# Altium project MAIN-VNH7070.PrjPcb
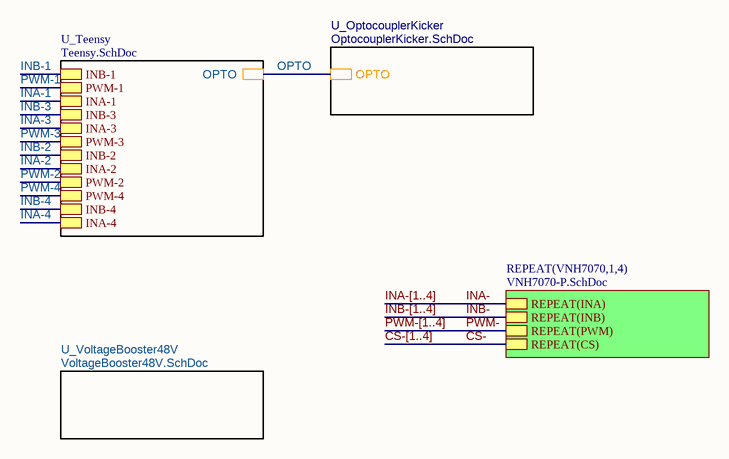
[diagram p0: TopLevel.SchDoc]
5 sheets, 108 parts. Net scope: hierarchical (ports join the sheet entries above them; power ports are global).
Board file: MAIN-VNH7070.PcbDoc
Sheets:
  TopLevel.SchDoc
    U_VoltageBooster48V = VoltageBooster48V.SchDoc
    U_Teensy = Teensy.SchDoc
    U_OptocouplerKicker = OptocouplerKicker.SchDoc
    VNH70701 = VNH7070-P.SchDoc
    VNH70702 = VNH7070-P.SchDoc
    VNH70703 = VNH7070-P.SchDoc
    VNH70704 = VNH7070-P.SchDoc

## Sheet TopLevel.SchDoc
size A; SheetNumber: 1; SheetTotal: 5

### Sub-sheets
REPEAT(VNH7070,1,4) = VNH7070-P.SchDoc: REPEAT(INA), REPEAT(INB), REPEAT(PWM), REPEAT(CS)
U_OptocouplerKicker = OptocouplerKicker.SchDoc: OPTO
U_Teensy = Teensy.SchDoc: OPTO, INB-1, PWM-1, INA-1, INB-3, INA-3, PWM-3, INB-2, INA-2, PWM-2, PWM-4, INB-4, INA-4
U_VoltageBooster48V = VoltageBooster48V.SchDoc: no entries

### Nets
CS-: sheet REPEAT(VNH7070,1,4)/REPEAT(CS)
INA-: sheet REPEAT(VNH7070,1,4)/REPEAT(INA)
INB-: sheet REPEAT(VNH7070,1,4)/REPEAT(INB)
OPTO: sheet U_Teensy/OPTO, sheet U_OptocouplerKicker/OPTO
PWM-: sheet REPEAT(VNH7070,1,4)/REPEAT(PWM)

### Buses and harness runs
bus CS-[1..4]
bus INA-[1..4]
bus INB-[1..4]
bus PWM-[1..4]

## Sheet VoltageBooster48V.SchDoc
size A; SheetNumber: 5; SheetTotal: 5
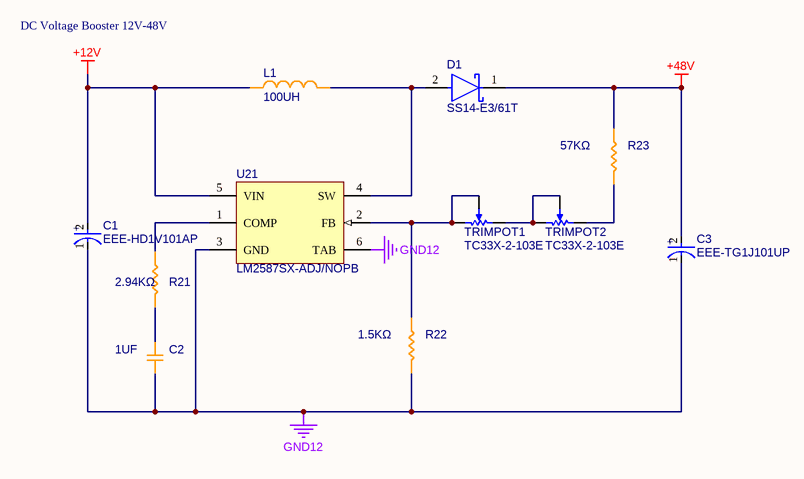
[diagram p1: VoltageBooster48V.SchDoc]

### Parts
C1  EEE-HD1V101AP  [FP-HDG-MFG]
C2  1UF  [CAP_0603]
C3  EEE-TG1J101UP  [FP-TGG-MFG]
D1  SS14-E3/61T  [FP-95400-MFG]
L1  100UH  [IND_Boost]
R21  2.94KΩ  [RES_0603]
R22  1.5KΩ  [RES_0603]
R23  57KΩ  [RES_0603]
TRIMPOT1  TC33X-2-103E  [BOUR-TC33X-2_V]
TRIMPOT2  TC33X-2-103E  [BOUR-TC33X-2_V]
U21  LM2587SX-ADJ/NOPB  [KTT0005B_N]

### Nets
+12V: C1.2(A) L1.1 U21.5(VIN)
+48V: C3.2(A) D1.1(C) R23.2
GND12: C1.1(C) C2.1 C3.1(C) R22.1 U21.3(GND) U21.6(TAB)  [project net GND]
NetC2_2: C2.2 R21.1
NetD1_2: D1.2(A) L1.2 U21.4(SW)
NetR21_2: R21.2 U21.1(COMP)
NetR22_2: R22.2 TRIMPOT1.1 TRIMPOT1.2 U21.2(FB)
NetR23_1: R23.1 TRIMPOT2.3
NetTRIMPOT1_3: TRIMPOT1.3 TRIMPOT2.1 TRIMPOT2.2

### Notes on the sheet
- DC Voltage Booster 12V-48V
- (in symbol CMP-00287-42869300-1) +
- (in symbol CMP-05427-002169-1) +

### Library data of the parts
C1 = CMP-00287-42869300-1: EEE-HD1V101AP Aluminum Electrolytic Capacitor, 100 uF, 35 V, ± 20%, 5000 hours @ 105°C, Radial Can - SMD; Voltage: 35V; ESR (Equivalent Series Resistance): 800mΩ; Ripple Current (AC): 101mA; Leakage Current: 35µA; Dissipation Factor: 14%; Dielectric Material: Aluminium; Capacitance: 100µF; Lifecycle Status: Production; Life (Hours): 5000hours; Tolerance: 20%; Height - Seated (Max): 10.2108mm; Number of Pins: 2; Length: 10.5mm; REACH SVHC: No SVHC; Min Operating Temperature: -40°C; Mount: PCB, Surface Mount; Lead Pitch: 4.6mm; Voltage Rating (DC): 35V; Lead Free: Lead Free; RoHS: Compliant; Ripple Current: 101mA; Height: 10.2mm; Termination: SMD/SMT; NexarPartId: 42869300; Packaging: Cut Tape; Radiation Hardening: No; Case/Package: Radial; Voltage Rating: 35V; Schedule B: 8532220020, 8532220020; Diameter: 10mm; Max Operating Temperature: 105°C; Impedance: 800mΩ
C2 = CAP_0603: Capacitor SMD 0603 generic
C3 = CMP-05427-002169-1: CAP ALUM 100UF 20% 63V SMD; ESR (Equivalent Series Resistance): 800mR; Ripple Current: 150mA; Dissipation Factor: 0.12%; Life (Hours): 2000Hour; Package Quantity: 500; Series: TG; Height: 10.2mm; Construction: Cylindrical; Lead Free: Lead Free; Ratings: AEC-Q200; Mount: Surface Mount; Termination: SMD/SMT; Case/Package: Radial; Length: 10.2mm; Diameter: 10mm; Height - Seated (Max): 0.402inch; Reach SVHC Compliant: Yes; Capacitance: 100uF; Packaging: Tape and Reel; Max Operating Temperature: 125°C; Voltage: 63V; RoHS Compliant: Yes; Tolerance: 20%; Min Operating Temperature: -40°C; Voltage Rating: 63V; Width: 900um; Ripple Current (AC): 150mA; Voltage Rating (DC): 63V; Contact Plating: Tin; Radiation Hardening: No
D1 = CMP-02539-000035-1: DIODE SCHOTTKY 40V 1A DO214AC; Manufacturer: Vishay; Peak Reverse Current: 0.2mA; Standoff Height: 0mm; Max Junction Temp: +150°C; Max Surge Forward Current: 40A; RoHS: TRUE; Digikey Description: DIODE SCHOTTKY 40V 1A DO214AC; Category: Diode; Device Class L3: Schottky Diodes; Temperature Range High: +150°C; Automotive: No; Temperature: -65°C to +150°C; Device Class L2: Diodes; Forward Current: 1A; Temperature Range Low: -65°C; Footprint Url: http://www.vishay.com/docs/95400/sma.pdf; Octopart: https://octopart.com/ss14-e3%2F61t-vishay-39552847; Package: 95400; Max Repetitive Reverse Voltage: 40V; ComponentLink2Description: Datasheet; ComponentLink2URL: http://www.vishay.com/docs/88746/ss12.pdf; Lead Free: Yes; Height: 2.29mm; Mouser Description: SS14 Series 40 V 1 A Surface Mount Schottky Barrier Rectifier - DO-214AC (SMA); Manufacturer Part Number: SS14-E3/61T; Device Class L1: Discrete Semiconductors
L1 = Boost Inductor: Voltage Boost Inductor
R21-R23 = RES_0603: Resistor SMD 0603 generic
TRIMPOT1 TRIMPOT2 = CMP-2100-03695-1: Trimming Potentiometer, 10000 Ohm, -40 to 100 degC, 3-Pin SMD, RoHS, Tape and Reel; Manufacturer: Bourns; Tolerance: 25%; Max Power Dissipation: 100mW; Number of Turns: 1; Resistance: 10KOhm; Temperature Coefficient: 250ppm/degreesC; Voltage Rating (DC): 50V; Datasheet URL: http://www.bourns.com/docs/Product-Datasheets/TC33.pdf; Composition: Potentiometer; Package Description: 3-Pin Surface Mount Device, Body 3.8 x 3.6 mm; Weight: 29.4mg; Power Rating: 100mW; Termination: FootPrint; Manufacturer URL: http://www.bourns.com/; Width: 0.118inch; Height: 0.047inch; Military Standard: Not; Radiation Hardening: No; Colour: Silver; Case/Package: SMD/SMT; Depth: 3.8mm; Min Operating Temperature: -40degC; Lead Free: LeadFree; Datasheet Version: 42583.0; REACH SVHC: NoSVHC; Length: 3mm; RoHSCompliant: true; Contact Plating: Silver; Taper: Linear; Packaging: TapeandReel; Mount: SurfaceMount; Max Operating Temperature: 100degC; Package Reference: TC33X-2; Package Quantity: 2500
U21 = CMP-0069-00069-3: 5A Flyback Regulator, 5-pin TO-263, Pb-Free; Manufacturer: Texas Instruments; PowerWise: N; CompType: Switcher; PackageTopMarking: NSUZXYTTE#*LM2587S*-ADJ P+; PackageDescription: TO-263, Molded, .400 x .390 x .180in, 5 Lead, .067in Pitch, Surface Mount; ComponentLink1URL: http://www.ti.com/general/docs/lit/getliterature.tsp?genericPartNumber=LM2587&fileType=pdf; Code_JEDEC: MO-169-AB; PinCount: 5; PackageReference: KTT0005B; ComponentLink1Description: Datasheet URL; RoHS: Y

## Sheet Teensy.SchDoc
size A; SheetNumber: 2; SheetTotal: 5
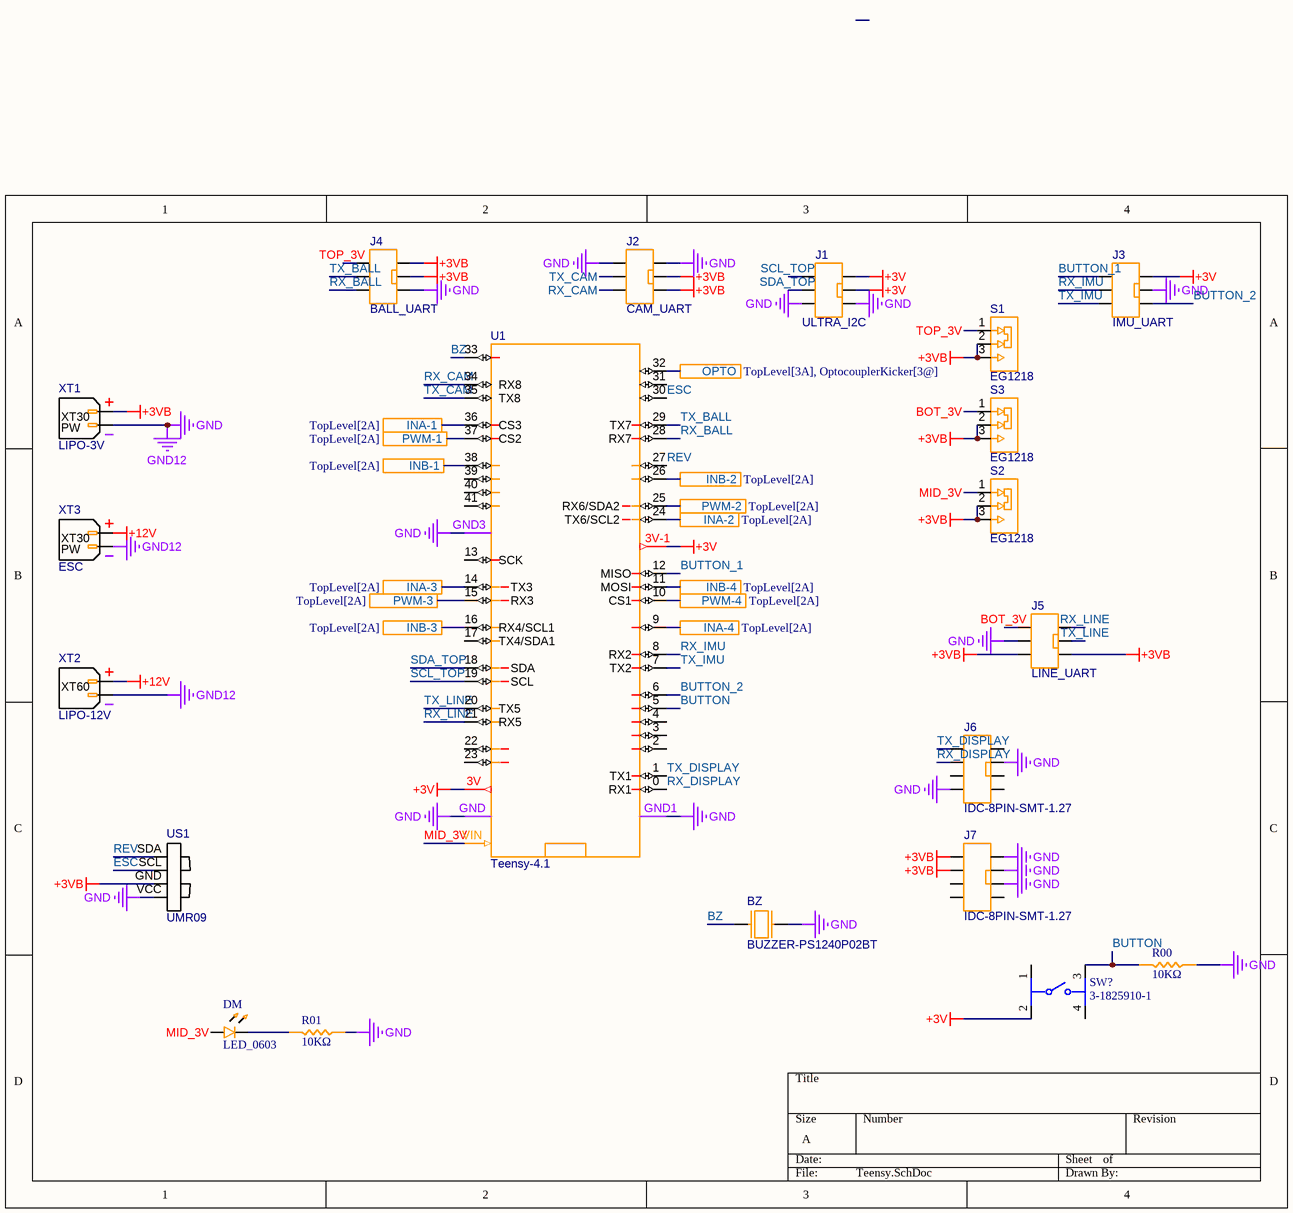
[diagram p2: Teensy.SchDoc]

### Parts
BZ  BUZZER-PS1240P02BT  [BUZZER-PS1240P02BT]
DM  LED_0603  [LED_0603]
J1  ULTRA_I2C  [IDC-6PIN-SMT-2.54]
J2  CAM_UART  [IDC-6PIN-SMT-2.54]
J3  IMU_UART  [IDC-6PIN-SMT-2.54]
J4  BALL_UART  [IDC-6PIN-SMT-2.54]
J5  LINE_UART  [IDC-6PIN-SMT-2.54]
J6  IDC-8PIN-SMT-1.27  [IDC-8PIN-SMT-1.27]
J7  IDC-8PIN-SMT-1.27  [IDC-8PIN-SMT-1.27]
R00  10KΩ  [RES_0603]
R01  10KΩ  [RES_0603]
S1  EG1218  [EG1218]
S2  EG1218  [EG1218]
S3  EG1218  [EG1218]
SW?  3-1825910-1  [FP-3-1825910-1-MFG]
U1  Teensy-4.1  [Teensy-4.1]
US1  UMR09  [URM09]
XT1  LIPO-3V  [XT30_PW_M]
XT2  LIPO-12V  [XT60-M]
XT3  ESC  [XT30_PW_M]

### Ports
INA-1 (see TopLevel[2A]), INA-2 (see TopLevel[2A]), INA-3 (see TopLevel[2A]), INA-4 (see TopLevel[2A]), INB-1 (see TopLevel[2A]), INB-2 (see TopLevel[2A]), INB-3 (see TopLevel[2A]), INB-4 (see TopLevel[2A]), OPTO (see TopLevel[3A], OptocouplerKicker[3@]), PWM-1 (see TopLevel[2A]), PWM-2 (see TopLevel[2A]), PWM-3 (see TopLevel[2A]), PWM-4 (see TopLevel[2A])

### Nets
+3V: J1.5 J1.6 J3.6 SW?.2 U1.3V U1.3V-1
+3VB: J2.4 J2.5 J4.5 J4.6 J5.3 J5.4 J7.1 J7.2 S1.2(COM) S1.3(NO) S2.2(COM) S2.3(NO) S3.2(COM) S3.3(NO) US1.GND XT1.P
+12V: XT2.P XT3.P
GND: BZ.2 J1.3 J1.4 J2.1 J2.6 J3.5 J4.4 J5.2 J6.4 J6.7 J7.6 J7.7 J7.8 R00.2 R01.2 U1.GND U1.GND1 U1.GND3 US1.VCC XT1.N XT2.N XT3.N  [also labelled GND12]
BOT_3V: J5.1 S3.1(NC)
BUTTON: R00.1 SW?.3 U1.5
BUTTON_1: J3.1 U1.12(MISO)
BUTTON_2: J3.4 U1.6
BZ: BZ.1 U1.33
ESC: U1.30 US1.SCL
INA-1: U1.36(CS3) ; port INA-1
INA-2: U1.24(TX6/SCL2) ; port INA-2
INA-3: U1.14(TX3) ; port INA-3
INA-4: U1.9 ; port INA-4
INB-1: U1.38 ; port INB-1
INB-2: U1.26 ; port INB-2
INB-3: U1.16(RX4/SCL1) ; port INB-3
INB-4: U1.11(MOSI) ; port INB-4
MID_3V: DM.A S2.1(NC) U1.VIN
OPTO: U1.32 ; port OPTO
PWM-1: U1.37(CS2) ; port PWM-1
PWM-2: U1.25(RX6/SDA2) ; port PWM-2
PWM-3: U1.15(RX3) ; port PWM-3
PWM-4: U1.10(CS1) ; port PWM-4
REV: U1.27 US1.SDA
RX_BALL: J4.3 U1.28(RX7)
RX_CAM: J2.3 U1.34(RX8)
RX_DISPLAY: J6.2 U1.0(RX1)
RX_IMU: J3.2 U1.8(RX2)
RX_LINE: J5.6 U1.21(RX5)
SCL_TOP: J1.1 U1.19(SCL)
SDA_TOP: J1.2 U1.18(SDA)
TOP_3V: J4.1 S1.1(NC)
TX_BALL: J4.2 U1.29(TX7)
TX_CAM: J2.2 U1.35(TX8)
TX_DISPLAY: J6.1 U1.1(TX1)
TX_IMU: J3.3 U1.7(TX2)
TX_LINE: J5.5 U1.20(TX5)
NetDM_C: DM.C R01.1

Not connected (* = marked no-connect by the designer): J6 3 5 6 8; J7 3 4 5; SW? 1 4; U1 2 3 4 13(SCK) 17(TX4/SDA1) 22 23 31 39 40 41

### Notes on the sheet
- (in symbol XT30_PW_M) XT30; PW
- (in symbol XT60-M) XT60

### Library data of the parts
J1-J5 = IDC-6PIN-SMT-2.54_1
R00 R01 = RES_0603: Resistor SMD 0603 generic
SW? = CMP-03407-000001-1: SWITCH TACTILE SPST-NO 0.05A 24V; Manufacturer: TE Connectivity; Operating Force: 160gf; Contact Current Rating: 50mA; Description: Switch Tactile OFF (ON) SPST Round Button PC Pins 0.05A 24VDC 100000Cycles 1.57N Thru-Hole; Contact Resistance: 100mΩ; Electromechanical Life: 100000Cycles; Device Class L1: Electromechanical; ComponentLink2URL: https://www.te.com/commerce/DocumentDelivery/DDEController?Action=srchrtrv&DocNm=1825910&DocType=Customer+Drawing&DocLang=English; Category: Switch; Device Class L2: Switches; Temperature: -35°C to +85°C; RoHS: TRUE; Mount: Through Hole; Manufacturer Part Number: 3-1825910-1; Automotive: No; Lead Free: Yes; Device Class L3: Tactile Switches; ComponentLink2Description: Datasheet; Temperature Range High: +85°C; Height: 17.3mm; Package: 0; Temperature Range Low: -35°C; Throw Configuration: SPST-NO; Digikey Description: SWITCH TACTILE SPST-NO 0.05A 24V; Octopart: https://octopart.com/3-1825910-1-te+connectivity-46506874
XT1 XT3 = XT30_PW_M
XT2 = XT60-M

## Sheet OptocouplerKicker.SchDoc
size A; SheetNumber: 3; SheetTotal: 5
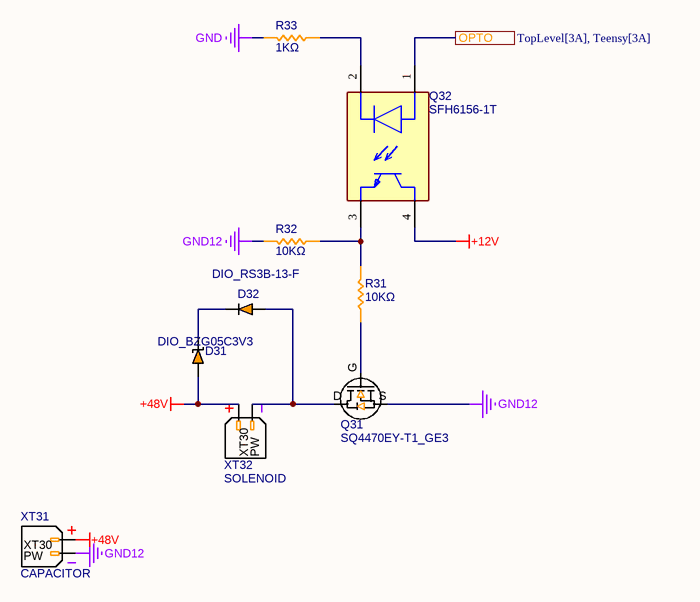
[diagram p3: OptocouplerKicker.SchDoc]

### Parts
D31  DIO_BZG05C3V3  [DIO_BZG05C3V3]
D32  DIO_RS3B-13-F  [DIO_RS3B-13-F]
Q31  SQ4470EY-T1_GE3  [SQ4470EY-T1_GE3]
Q32  SFH6156-1T  [FP-83911-MFG]
R31  10KΩ  [RES_0603]
R32  10KΩ  [RES_0603]
R33  1KΩ  [RES_0603]
XT31  CAPACITOR  [XT30_PW_M]
XT32  SOLENOID  [XT30_PW_M]

### Ports
OPTO (see TopLevel[3A], Teensy[3A])

### Nets
+12V: Q32.4(C)
+48V: D31.A XT31.P XT32.P
GND: Q31.S R32.1 R33.1 XT31.N  [also labelled GND12]
OPTO: Q32.1(A) ; port OPTO
NetD31_C: D31.C D32.C
NetD32_A: D32.A Q31.D XT32.N
NetQ31_G: Q31.G R31.2
NetQ32_2: Q32.2(C) R33.2
NetQ32_3: Q32.3(E) R31.1 R32.2

### Notes on the sheet
- (in symbol XT30_PW_M) XT30; PW

### Library data of the parts
Q32 = CMP-00030-03895371-1: SFH6156-1T Optocoupler Dc-in 1-CH Transistor Dc-out 4-PIN PDIP SMD T/r; Fall Time: 11s; Number of Elements: 1; Output Voltage: 70V; Forward Current: 60mA; Forward Voltage: 1.25V; Turn-On Delay Time: 3µs; Power Dissipation: 150mW; Isolation Voltage: 5.3kV; Collector Emitter Saturation Voltage: 400mV; Output Current per Channel: 50mA; Reverse Breakdown Voltage: 6V; Max Collector Current: 100mA; Current Transfer Ratio: 80%; Rise Time: 2s; Turn-Off Delay Time: 2.3µs; Mount: PCB, Surface Mount; NexarPartId: 3895371; Ambient Temperature Range High: 100°C; Number of Channels: 1; Number of Pins: 4; RoHS: Compliant; Max Output Voltage: 70V; Case/Package: SMD/SMT; Radiation Hardening: No; Max Input Current: 60mA; Height: 4.059mm; Max Power Dissipation: 150mW; Packaging: Digi-Reel®; Max Operating Temperature: 100°C; Schedule B: 8541408000, 8541408000; Reverse Voltage: 6V; Lead Free: Lead Free; Min Operating Temperature: -55°C; Collector Emitter Voltage (VCEO): 70V; Input Current: 60mA
R31-R33 = RES_0603: Resistor SMD 0603 generic
XT31 XT32 = XT30_PW_M

## Sheet VNH7070-P.SchDoc
size A; SheetNumber: 4; SheetTotal: 5
Used 4 times, as channels VNH70701, VNH70702, VNH70703, VNH70704. Parts and nets are listed once, with the designators drawn on the sheet.
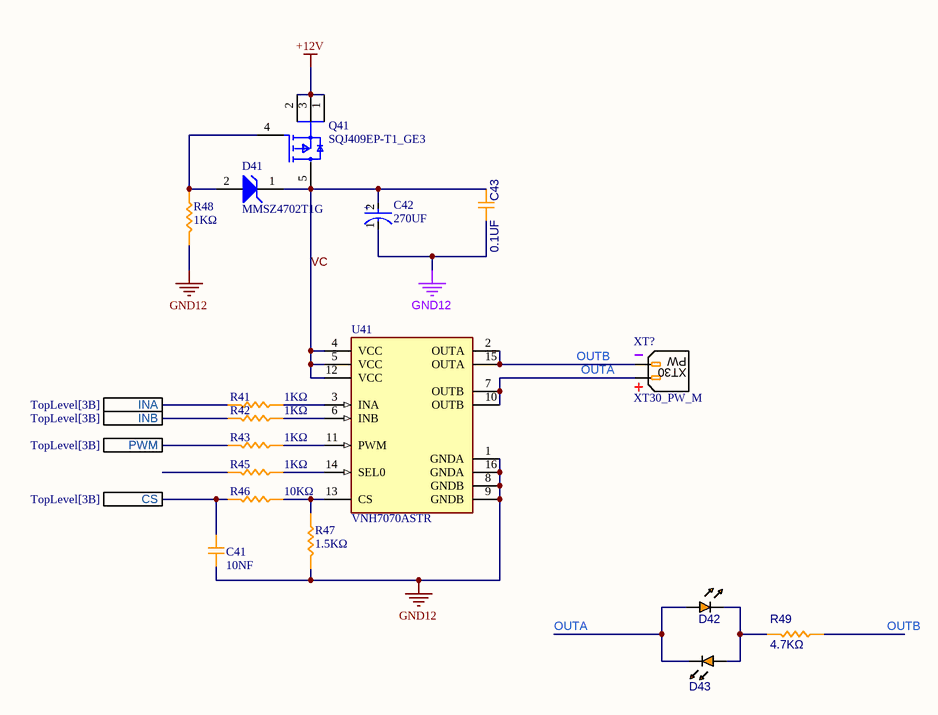
[diagram p4: VNH7070-P.SchDoc]

### Parts
C41  10NF  [CAP_0603]
C42  270UF  [FP-FTD8-MFG]
C43  0.1UF  [CAP_0603]
D41  MMSZ4702T1G  [ONSC-SOD-123-2-425-04_V]
D42  LED_0603  [LED_0603]  (value not drawn)
D43  LED_0603  [LED_0603]  (value not drawn)
Q41  SQJ409EP-T1_GE3  [FP-T16-0221-SINGLE-MFG]
R41  1KΩ  [RES_0603]
R42  1KΩ  [RES_0603]
R43  1KΩ  [RES_0603]
R45  1KΩ  [RES_0603]
R46  10KΩ  [RES_0603]
R47  1.5KΩ  [RES_0603]
R48  1KΩ  [RES_0603]
R49  4.7KΩ  [RES_0603]
U41  VNH7070ASTR  [FP-SO-16N-GAPGCFT00818-MFG]
XT?  XT30_PW_M  [XT30_PW_M]

### Ports
CS (see TopLevel[3B]), INA (see TopLevel[3B]), INB (see TopLevel[3B]), PWM (see TopLevel[3B])

### Nets
+12V: Q41.1(S) Q41.2(S) Q41.3(S)
GND12: C41.1 C42.1(C) C43.2 R47.1 R48.1 U41.1(GNDA) U41.8(GNDB) U41.9(GNDB) U41.16(GNDA)
CS: C41.2 R46.1 ; port CS
INA: R41.1 ; port INA
INB: R42.1 ; port INB
OUTA: D42.A D43.C U41.7(OUTB) U41.10(OUTB) XT?.P
OUTB: R49.2 U41.2(OUTA) U41.15(OUTA) XT?.N
PWM: R43.1 ; port PWM
VC: C42.2(A) C43.1 D41.1(K) Q41.5(D) U41.4(VCC) U41.5(VCC) U41.12(VCC)
NetD41_2: D41.2(A) Q41.4(G) R48.2
NetD42_C: D42.C D43.A R49.1
NetR41_2: R41.2 U41.3(INA)
NetR42_2: R42.2 U41.6(INB)
NetR43_2: R43.2 U41.11(PWM)
NetR45_2: R45.2 U41.14(SEL0)
NetR46_2: R46.2 R47.2 U41.13(CS)

Not connected (* = marked no-connect by the designer): R45 1

### Channels
VNH70701: designators end in -1; ports CS=CS-1 INA=INA-1 INB=INB-1 PWM=PWM-1
VNH70702: designators end in -2; ports CS=CS-2 INA=INA-2 INB=INB-2 PWM=PWM-2
VNH70703: designators end in -3; ports CS=CS-3 INA=INA-3 INB=INB-3 PWM=PWM-3
VNH70704: designators end in -4; ports CS=CS-4 INA=INA-4 INB=INB-4 PWM=PWM-4

### Notes on the sheet
- (in symbol CMP-05427-000088-1) +
- (in symbol XT30_PW_M) PW; XT30

### Library data of the parts
C41 C43 = CAP_0603: Capacitor SMD 0603 generic
C42 = CMP-05427-000088-1: CAP ALUM 220UF 20% 25V SMD; Dielectric Material: Aluminium; ESR (Equivalent Series Resistance): 160mR; Ripple Current: 600mA; Life (Hours): 2000Hour; Leakage Current: 55uA; Lead Diameter: 0.65mm; Series: FT; RoHS Compliant: Yes; Case/Package: Radial; Packaging: Tape and Reel; Contact Plating: Tin; Package Quantity: 1; Mount: Surface Mount; Number of Pins: 8; Tolerance: 20%; Height - Seated (Max): 0.315inch; Length: 7.7mm; Lead Free: Lead Free; Voltage: 25V; Construction: Cylindrical; Radiation Hardening: No; Lead Pitch: 1.8mm; REACH SVHC: No SVHC; Capacitance: 220uF; Voltage Rating: 25V; Height: 7.7mm; Diameter: 6.3mm; Max Operating Temperature: 105°C; Termination: SMD/SMT; Min Operating Temperature: -55°C; Voltage Rating (DC): 25V; Ripple Current (AC): 600mA
D41 = CMP-1060-00296-1: Zener Voltage Regulator, 500 mW, 2-Pin SOD-123, Pb-Free, Tape and Reel; Manufacturer: On Semiconductor; VZ Typ (V): 15; P Max (W): 0.5; PackageVersion: Rev. G, 10/2009; ComponentLink3URL: http://www.onsemi.com/pub_link/Collateral/425-04.PDF; PackageReference: SOD-123-2-425-04; ComponentLink2URL: http://www.onsemi.com/pub_link/Collateral/MMSZ4678T1-D.PDF; PartNumber: MMSZ4702T1G; ComponentLink3Description: Package Specification; PackageDescription: 2-Pin SOD, Body 1.6 x 2.69 mm; ComponentLink1Description: Manufacturer URL; ComponentLink1URL: http://www.onsemi.com/; ComponentLink2Description: Datasheet; DatasheetVersion: Rev. 9; Packing: Tape and Reel; Mounting Technology: Surface Mount; RoHS: Pb-Free
Q41 = CMP-02550-000144-1: MOSFET P-CH 40V 60A POWERPAKSO-8; Manufacturer: Vishay; Number Of P Channels: 1; Reverse Recovery Time: 39ns; Standoff Height: 0mm; Automotive Grade: Grade 0; Continuous Drain Current: -60A; Gate Charge At Vgs: 170nC @ -10V; Power Dissipation: 68W; Input Capacitace At Vds: 8400pF @ -25V; Drain To Source Resistance: 0.0058Ω; Depletion Mode: False; Rthja Max: 68°C/W; Gate To Source Voltage: 20V; Drain To Source Voltage: -40V; Threshold Vgs Max: -2.5V; Turn Off Delay Time: 75ns; Threshold Vgs Min: -1.5V; Reverse Recovery Charge: 45nC; Turn On Delay Time: 23ns; Typ Forward Diode Voltage: -0.76V; Transconductance: 54S; Max Junction Temp: +175°C; Max Forward Diode Voltage: -1.2V; Pulse Drain Current: -150A; Digikey Description: MOSFET P-CH 40V 60A POWERPAKSO-8; Device Class L2: Transistors; Height: 1.267mm; Octopart: https://octopart.com/sqj409ep-t1_ge3-vishay-82218774; Device Class L3: MOSFETs; ComponentLink2URL: https://www.vishay.com/docs/77707/sqj409ep.pdf; ComponentLink2Description: Datasheet; Footprint Url: http://www.vishay.com/docs/63818/ppso8ls.pdf; Device Class L1: Discrete Semiconductors; Temperature: -55°C to +175°C; Package: T16-0221-SINGLE; Drain To Source Breakdown Voltage: -40V; Automotive: Yes; Manufacturer Part Number: SQJ409EP-T1_GE3; Temperature Range High: +175°C; Mouser Description: Trans MOSFET P-CH 40V 60A Automotive 5-Pin(4+Tab) PowerPAK SO T/R; RoHS: TRUE; Temperature Range Low: -55°C; Category: Trans; Lead Free: Yes; Number Of Channels: 1
R41-R43 R45-R49 = RES_0603: Resistor SMD 0603 generic
U41 = CMP-2000-07519-2: IC MOTOR DRIVER 4V-28V 16SOIC; Manufacturer: STMicroelectronics; Standoff Height: 0.1mm; Number Of Outputs: 2; Max Junction Temp: +150°C; Output Current: 15A; Max Supply Voltage: 28V; Automotive Grade: Grade 0; Motor Type: Brushed; Min Supply Voltage: 4V; Nominal Supply Current: 2-3.5mA; Digikey Description: IC MOTOR DRIVER 4V-28V 16SOIC; Device Class L1: Integrated Circuits (ICs); Ipc Land Pattern Name: SOIC127P600X175-16; Device Class L2: Power Management ICs; ComponentLink2Description: Datasheet; ComponentLink2URL: https://www.st.com/resource/en/datasheet/vnh7070as.pdf; Height: 1.75mm; RoHS: TRUE; Manufacturer Part Number: VNH7070ASTR; Octopart: https://octopart.com/vnh7070astr-stmicroelectronics-66668687; Temperature Range Low: -40°C; Mouser Description: STMicroelectronics VNH7070ASTR Motor Driver IC 16-Pin, SOIC; Device Class L3: Motor Drivers; Lead Free: Yes; Temperature: -40°C to +150°C; Automotive: Yes; Package: SO-16N-GAPGCFT00818; Temperature Range High: +150°C; Category: IC; Footprint Url: https://www.st.com/resource/en/datasheet/l6566a.pdf

## Nets that join several sheets
+12V: VoltageBooster48V (C1.2 L1.1 U21.5), Teensy (XT2.P XT3.P), OptocouplerKicker (Q32.4), VNH70701 (Q41-1.1 Q41-1.2 Q41-1.3), VNH70702 (Q41-2.1 Q41-2.2 Q41-2.3), VNH70703 (Q41-3.1 Q41-3.2 Q41-3.3), VNH70704 (Q41-4.1 Q41-4.2 Q41-4.3)
+48V: VoltageBooster48V (C3.2 D1.1 R23.2), OptocouplerKicker (D31.A XT31.P XT32.P)
GND: VoltageBooster48V (6 pins), Teensy (22 pins), OptocouplerKicker (Q31.S R32.1 R33.1 XT31.N), VNH70701 (9 pins), VNH70702 (9 pins), VNH70703 (9 pins), VNH70704 (9 pins)
INA-1: Teensy (U1.36), VNH70701 (R41-1.1)
INA-2: Teensy (U1.24), VNH70702 (R41-2.1)
INA-3: Teensy (U1.14), VNH70703 (R41-3.1)
INA-4: Teensy (U1.9), VNH70704 (R41-4.1)
INB-1: Teensy (U1.38), VNH70701 (R42-1.1)
INB-2: Teensy (U1.26), VNH70702 (R42-2.1)
INB-3: Teensy (U1.16), VNH70703 (R42-3.1)
INB-4: Teensy (U1.11), VNH70704 (R42-4.1)
OPTO: Teensy (U1.32), OptocouplerKicker (Q32.1)
PWM-1: Teensy (U1.37), VNH70701 (R43-1.1)
PWM-2: Teensy (U1.25), VNH70702 (R43-2.1)
PWM-3: Teensy (U1.15), VNH70703 (R43-3.1)
PWM-4: Teensy (U1.10), VNH70704 (R43-4.1)